# Altium schematic sheet [17] - LVDS, CSI.SchDoc
size A2; DocumentNumber: 17; SheetNumber: 17; SheetTotal: 32
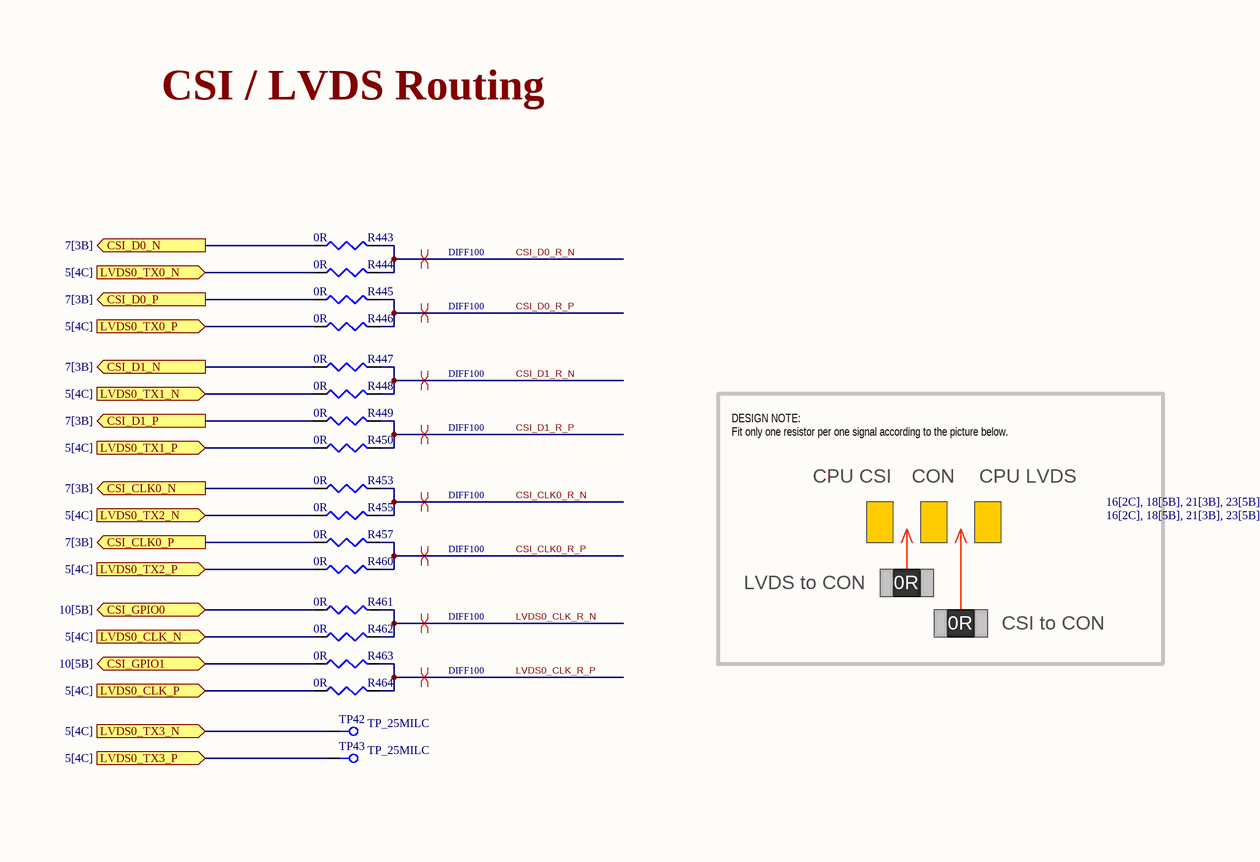
[diagram p0: [17] - LVDS, CSI.SchDoc, top left]
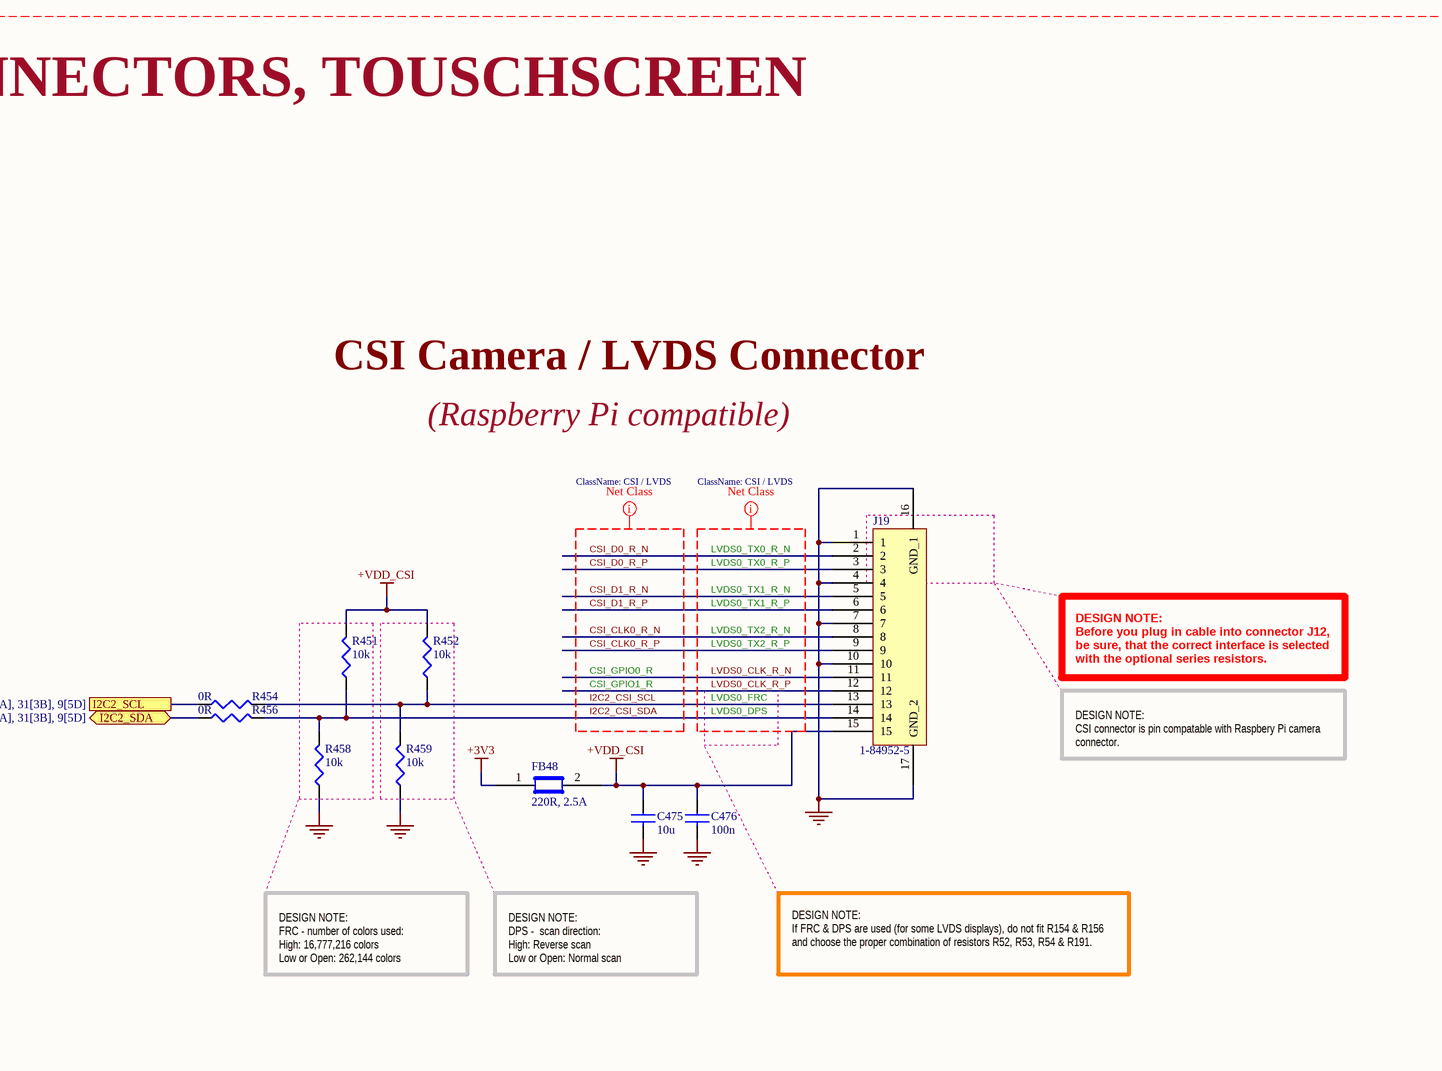
[diagram p1: [17] - LVDS, CSI.SchDoc, top right]
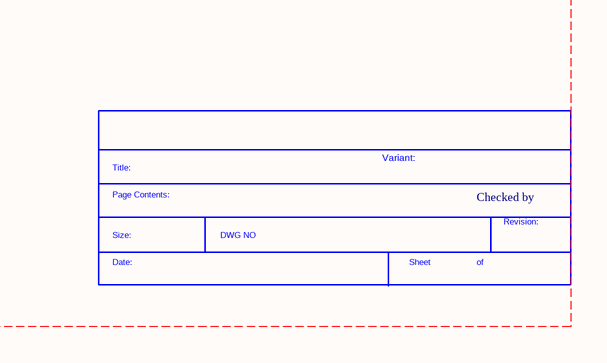
[diagram p2: [17] - LVDS, CSI.SchDoc, bottom right]

## Parts
*  SDTitleBlock  (value not drawn)  (graphical)
C475  10u  [C0603]
C476  100n  [C0402]
FB48  220R, 2.5A  [C0603]
J19  1-84952-5  [ZIF_RA_BOTTOM_15x1mm]
R443  0R  [R0402]
R444  0R  [R0402]
R445  0R  [R0402]
R446  0R  [R0402]
R447  0R  [R0402]
R448  0R  [R0402]
R449  0R  [R0402]
R450  0R  [R0402]
R451  10k  [R0402]
R452  10k  [R0402]
R453  0R  [R0402]
R454  0R  [R0402]
R455  0R  [R0402]
R456  0R  [R0402]
R457  0R  [R0402]
R458  10k  [R0402]
R459  10k  [R0402]
R460  0R  [R0402]
R461  0R  [R0402]
R462  0R  [R0402]
R463  0R  [R0402]
R464  0R  [R0402]
TP42  TP_25MILC  [TP_25C]  (no BOM)
TP43  TP_25MILC  [TP_25C]  (no BOM)

## Ports
CSI_CLK0_N (out, see 7[3B]), CSI_CLK0_P (out, see 7[3B]), CSI_D0_N (out, see 7[3B]), CSI_D0_P (out, see 7[3B]), CSI_D1_N (out, see 7[3B]), CSI_D1_P (out, see 7[3B]), CSI_GPIO0 (bidir, see 10[5B]), CSI_GPIO1 (bidir, see 10[5B]), I2C2_SCL (see 16[2C], 18[5B], 21[3B], 23[5B], 24[2A], 31[3B], 9[5D]), I2C2_SDA (bidir, see 16[2C], 18[5B], 21[3B], 23[5B], 24[2A], 31[3B], 9[5D]), LVDS0_CLK_N (in, see 5[4C]), LVDS0_CLK_P (in, see 5[4C]), LVDS0_TX0_N (in, see 5[4C]), LVDS0_TX0_P (in, see 5[4C]), LVDS0_TX1_N (in, see 5[4C]), LVDS0_TX1_P (in, see 5[4C]), LVDS0_TX2_N (in, see 5[4C]), LVDS0_TX2_P (in, see 5[4C]), LVDS0_TX3_N (in, see 5[4C]), LVDS0_TX3_P (in, see 5[4C])

## Nets
+3V3: FB48.1
+VDD_CSI: C475.1 C476.1 FB48.2 J19.15 R451.2 R452.2
GND: C475.2 C476.2 J19.1 J19.4 J19.7 J19.10 J19.16(GND_1) J19.17(GND_2) R458.1 R459.1
CSI_CLK0_N: R453.1 ; port CSI_CLK0_N
CSI_CLK0_P: R457.1 ; port CSI_CLK0_P
CSI_CLK0_R_N: J19.8 R453.2 R455.2
CSI_CLK0_R_P: J19.9 R457.2 R460.2
CSI_D0_N: R443.1 ; port CSI_D0_N
CSI_D0_P: R445.1 ; port CSI_D0_P
CSI_D0_R_N: J19.2 R443.2 R444.2
CSI_D0_R_P: J19.3 R445.2 R446.2
CSI_D1_N: R447.1 ; port CSI_D1_N
CSI_D1_P: R449.1 ; port CSI_D1_P
CSI_D1_R_N: J19.5 R447.2 R448.2
CSI_D1_R_P: J19.6 R449.2 R450.2
CSI_GPIO0: R461.1 ; port CSI_GPIO0
CSI_GPIO1: R463.1 ; port CSI_GPIO1
I2C2_CSI_SCL: J19.13 R452.1 R454.2 R459.2
I2C2_CSI_SDA: J19.14 R451.1 R456.2 R458.2
I2C2_SCL: R454.1 ; port I2C2_SCL
I2C2_SDA: R456.1 ; port I2C2_SDA
LVDS0_CLK_N: R462.1 ; port LVDS0_CLK_N
LVDS0_CLK_P: R464.1 ; port LVDS0_CLK_P
LVDS0_CLK_R_N: J19.11 R461.2 R462.2
LVDS0_CLK_R_P: J19.12 R463.2 R464.2
LVDS0_TX0_N: R444.1 ; port LVDS0_TX0_N
LVDS0_TX0_P: R446.1 ; port LVDS0_TX0_P
LVDS0_TX1_N: R448.1 ; port LVDS0_TX1_N
LVDS0_TX1_P: R450.1 ; port LVDS0_TX1_P
LVDS0_TX2_N: R455.1 ; port LVDS0_TX2_N
LVDS0_TX2_P: R460.1 ; port LVDS0_TX2_P
LVDS0_TX3_N: TP42.1 ; port LVDS0_TX3_N
LVDS0_TX3_P: TP43.1 ; port LVDS0_TX3_P

## Layout directives
differential pair; net class DIFF100: CSI_CLK0_R_N, CSI_CLK0_R_P, CSI_D0_R_N, CSI_D0_R_P, CSI_D1_R_N, CSI_D1_R_P, LVDS0_CLK_R_N, LVDS0_CLK_R_P
net class CSI / LVDS: CSI_CLK0_R_N, CSI_CLK0_R_P, CSI_D0_R_N, CSI_D0_R_P, CSI_D1_R_N, CSI_D1_R_P, I2C2_CSI_SCL, I2C2_CSI_SDA, LVDS0_CLK_R_N, LVDS0_CLK_R_P
net class [17] - LVDS/CSI: +3V3, +VDD_CSI, CSI_CLK0_R_N, CSI_CLK0_R_P, CSI_D0_R_N, CSI_D0_R_P, CSI_D1_R_N, CSI_D1_R_P, GND, I2C2_CSI_SCL, I2C2_CSI_SDA, LVDS0_CLK_R_N, LVDS0_CLK_R_P

## Notes on the sheet
- LVDS / CSI, LCD / CSI1 CONNECTORS, TOUSCHSCREEN
- CSI / LVDS Routing
- (Raspberry Pi compatible)
- CSI Camera / LVDS Connector
- LVDS0_TX0_R_P
- LVDS0_TX0_R_N
- LVDS0_TX2_R_N
- LVDS0_TX1_R_N
- LVDS0_TX1_R_P
- DESIGN NOTE:
  Fit only one resistor per one signal according to the picture below.
- CPU CSI
- CON
- CPU LVDS
- CSI_GPIO1_R
- CSI_GPIO0_R
- LVDS0_TX2_R_P
- LVDS0_FRC
- DESIGN NOTE:
  Before you plug in cable into connector J12, be sure, that the correct interface is selected with the optional series resistors.
- LVDS0_DPS
- DESIGN NOTE:
  CSI connector is pin compatable with Raspbery Pi camera connector.
- LVDS to CON
- 0R
- CSI to CON
- DESIGN NOTE:
  FRC - number of colors used:
  High: 16,777,216 colors
  Low or Open: 262,144 colors
- DESIGN NOTE:
  DPS -  scan direction:
  High: Reverse scan
  Low or Open: Normal scan
- DESIGN NOTE:
  If FRC & DPS are used (for some LVDS displays), do not fit R154 & R156 and choose the proper combination of resistors R52, R53, R54 & R191.
- Variant:
- Checked by
- (in symbol SDTitleBlock) Title:; Page Contents:; Revision:; Size:; DWG NO; Date:; Sheet; of

## Library data of the parts
C475 = C1608X5R0J106M: CAP CER 10UF 6.3V X5R 20% 0603; Manufacturer: TDK Corporation; Capacitance: 10µF; Value: 10µF; .Checked PCB: used; Category: Capacitors; Supplier Part Number: 445-4112-1-ND; Manufacturer Part Number: C1608X5R0J106M; Operating Temperature: -55°C ~ 85°C; Package / Case: 0603 (1608 Metric); Price 1k [$]: 0.08580; .Checked SCH: used; Voltage - Rated: 6.3V; Features: Low ESR; Supplier: Digikey; Supplier 1: Digi-Key; Supplier Part Number 1: 445-4112-1-ND; RoHS: RoHS Compliant; Stock 1: 48157; Pricing 1: 1=0.46, 10=0.363, 100=0.1898, 250=0.14024, 500=0.1089, 1000=0.0858 (USD); Tolerance: ±20%; Temperature Coefficient: X5R; Mounting Type: Surface Mount, MLCC; Applications: General Purpose; Ratings: -; Size / Dimension: 0.063" L x 0.031" W (1.60mm x 0.80mm); Height - Seated (Max): -; Thickness (Max): 0.037" (0.95mm); Lead Spacing: -; Packaging: Cut Tape (CT); Lead Style: -; ComponentLink1URL: http://www.tdk.com/pdf/general_B11.pdf; ComponentLink1Description: http://www.tdk.com/pdf/general_B11.pdf
C476 = C1005X5R1H104K: CAP CER .10UF 50V X5R 10% 0402; Manufacturer: TDK Corporation; Capacitance: 0.1µF; Value: 100nF; .Checked PCB: used; Category: Capacitors; Supplier Part Number: 445-5942-1-ND; Manufacturer Part Number: C1005X5R1H104K; Operating Temperature: -55°C ~ 85°C; Package / Case: 0402 (1005 Metric); Price 1k [$]: 0.02340; .Checked SCH: used; Voltage - Rated: 50V; Supplier: Digikey; Supplier 1: Digi-Key; Supplier Part Number 1: 445-5942-1-ND; RoHS: RoHS Compliant; Stock 1: 106926; Pricing 1: 1=0.27, 10=0.18, 100=0.072, 250=0.05176, 500=0.0369, 1000=0.027 (USD); Tolerance: ±10%; Temperature Coefficient: X5R; Mounting Type: Surface Mount, MLCC; Applications: General Purpose; Ratings: -; Size / Dimension: 0.039" L x 0.020" W (1.00mm x 0.50mm); Height - Seated (Max): -; Thickness (Max): 0.022" (0.55mm); Lead Spacing: -; Features: -; Packaging: Cut Tape (CT); Lead Style: -; ComponentLink1URL: http://www.tdk.co.jp/tefe02/e412_c.pdf; ComponentLink1Description: http://www.tdk.co.jp/tefe02/e412_c.pdf; Supplier 2: Digi-Key; Supplier Part Number 2: 311-1697-6-ND
FB48 = BLM18SG221TN1D: FERRITE CHIP 220 OHM 2500MA 0603; Manufacturer: Murata Electronics North America; Impedance @ Frequency: 220 Ohm @ 100MHz; DC Resistance (DCR): 40 mOhm Max; Filter Type: Differential Mode - Single; Number of Lines: 1; .Checked PCB: used; Supplier 1: Digi-Key; Supplier Part Number 1: 490-5225-1-ND; Manufacturer Part Number: BLM18SG221TN1D; RoHS: RoHS Compliant; Category: Filters; Stock 1: 54640; Pricing 1: 1=0.38, 10=0.282, 50=0.1646, 100=0.1316, 250=0.094, 500=0.06392, 1000=0.0517, 5000=0.04042 (USD); Current Rating: 2.5A; Package / Case: 0603 (1608 Metric); Mounting Type: Surface Mount; Packaging: Cut Tape (CT); Height (Max): 0.037" (0.95mm); Size / Dimension: 0.063" L x 0.031" W (1.60mm x 0.80mm); ComponentLink1URL: http://search.murata.co.jp/Ceramy/image/img/PDF/ENG/L0110S0100BLM18S.pdf; ComponentLink1Description: http://search.murata.co.jp/Ceramy/image/img/PDF/ENG/L0110S0100BLM18S.pdf; .Checked SCH: used
J19 = 1-84952-5: CONN FPC BOTTOM 15POS 1.00MM R/A; Manufacturer: TE Connectivity; Connector/Contact Type: Contacts, Bottom; Number of Positions: 15; Pitch: 0.039" (1.00mm); FFC, FCB Thickness: 0.30mm; Locking Feature: Slide Lock; Cable End Type: Straight; Actuator Material: Polyamide (PA), Nylon, Glass Filled; Voltage Rating: 200V; Material Flammability Rating: UL94 V-0; Current Rating: 1A; .Creator: MM; .Checked PCB: used; Supplier 1: Digi-Key; Manufacturer Part Number: 1-84952-5; RoHS: RoHS Compliant; Category: Connectors, Interconnects; Stock 1: 3321; Pricing 1: 1=2.32, 10=2.107, 25=1.9776, 50=1.8918, 100=1.8057, 250=1.63376, 500=1.50478 (USD); Packaging: Cut Tape (CT); Flat Flex Type: FPC; Mounting Type: Surface Mount, Right Angle; Termination: Solder; Height Above Board: 0.101" (2.56mm); Contact Material: Phosphor Bronze; Contact Finish: Tin; Housing Material: Liquid Crystal Polymer (LCP), Glass Filled; Features: Solder Retention, Zero Insertion Force (ZIF); Operating Temperature: -40°C ~ 85°C; ComponentLink1URL: http://www.te.com/commerce/DocumentDelivery/DDEController?Action=srchrtrv&DocNm=84952&DocType=Customer+Drawing&DocLang=English; ComponentLink1Description: http://www.te.com/commerce/DocumentDelivery/DDEController?Action=srchrtrv&DocNm=84952&DocType=Customer+Drawing&DocLang=English; Supplier Part Number 1: A101391CT-ND; .Checked SCH: used
R443-R450 R453-R457 R460-R464 = RC0402JR-070RL: RES 0.0 OHM 1/16W 0402 SMD; Manufacturer: Yageo; Resistance (Ohms): 0.0; Power (Watts): 0.063W, 1/16W; Tolerance: Jumper; .Checked PCB: used; Category: Resistors; Manufacturer Part Number: RC0402JR-070RL; Package / Case: 0402 (1005 Metric); Price 1k [$]: 0.01389; Value: 0R; .Checked SCH: used; Supplier Part Number: 311-0.0JRCT-ND; Supplier: Digikey; Supplier 1: Digi-Key; Supplier Part Number 1: 311-0.0JRCT-ND; RoHS: RoHS Compliant; Stock 1: 1106330; Pricing 1: 10=0.012, 50=0.009, 100=0.0069, 250=0.00512, 500=0.0038, 1000=0.00253 (USD); Composition: Thick Film; Features: -; Temperature Coefficient: -; Size / Dimension: 0.039" L x 0.020" W (1.00mm x 0.50mm); Height: 0.016" (0.40mm); Number of Terminations: 2; Packaging: Cut Tape (CT); ComponentLink1URL: http://www.yageo.com/documents/recent/PYu-RC0402_51_RoHS_L_6.pdf; ComponentLink1Description: http://www.yageo.com/documents/recent/PYu-RC0402_51_RoHS_L_6.pdf
R451 R452 R458 R459 = RC0402FR-0710KL: RES 10.0K OHM 1/16W 1% 0402 SMD; Manufacturer: Yageo; Power (Watts): 0.063W, 1/16W; .Checked PCB: used; Temperature Coefficient: ±100ppm/°C; Category: Resistors; Supplier Part Number: 311-10.0KLRCT-ND; Manufacturer Part Number: RC0402FR-0710KL; Package / Case: 0402 (1005 Metric); Price 1k [$]: 0.01421; Resistance (Ohms): 10K; Tolerance: ±1%; Value: 10k; .Checked SCH: used; Supplier: Digikey; Supplier 1: Digi-Key; Supplier Part Number 1: 311-10.0KLRCT-ND; RoHS: RoHS Compliant; Stock 1: 2916495; Pricing 1: 10=0.014, 50=0.0104, 100=0.0079, 250=0.00584, 500=0.00432, 1000=0.00288 (USD); Composition: Thick Film; Features: -; Size / Dimension: 0.039" L x 0.020" W (1.00mm x 0.50mm); Height: 0.016" (0.40mm); Number of Terminations: 2; Packaging: Cut Tape (CT); ComponentLink1URL: http://www.yageo.com/documents/recent/PYu-RC0402_51_RoHS_L_6.pdf; ComponentLink1Description: http://www.yageo.com/documents/recent/PYu-RC0402_51_RoHS_L_6.pdf
TP42 TP43 = TP_25MILC: Test Point 25mil; .Checked PCB: used